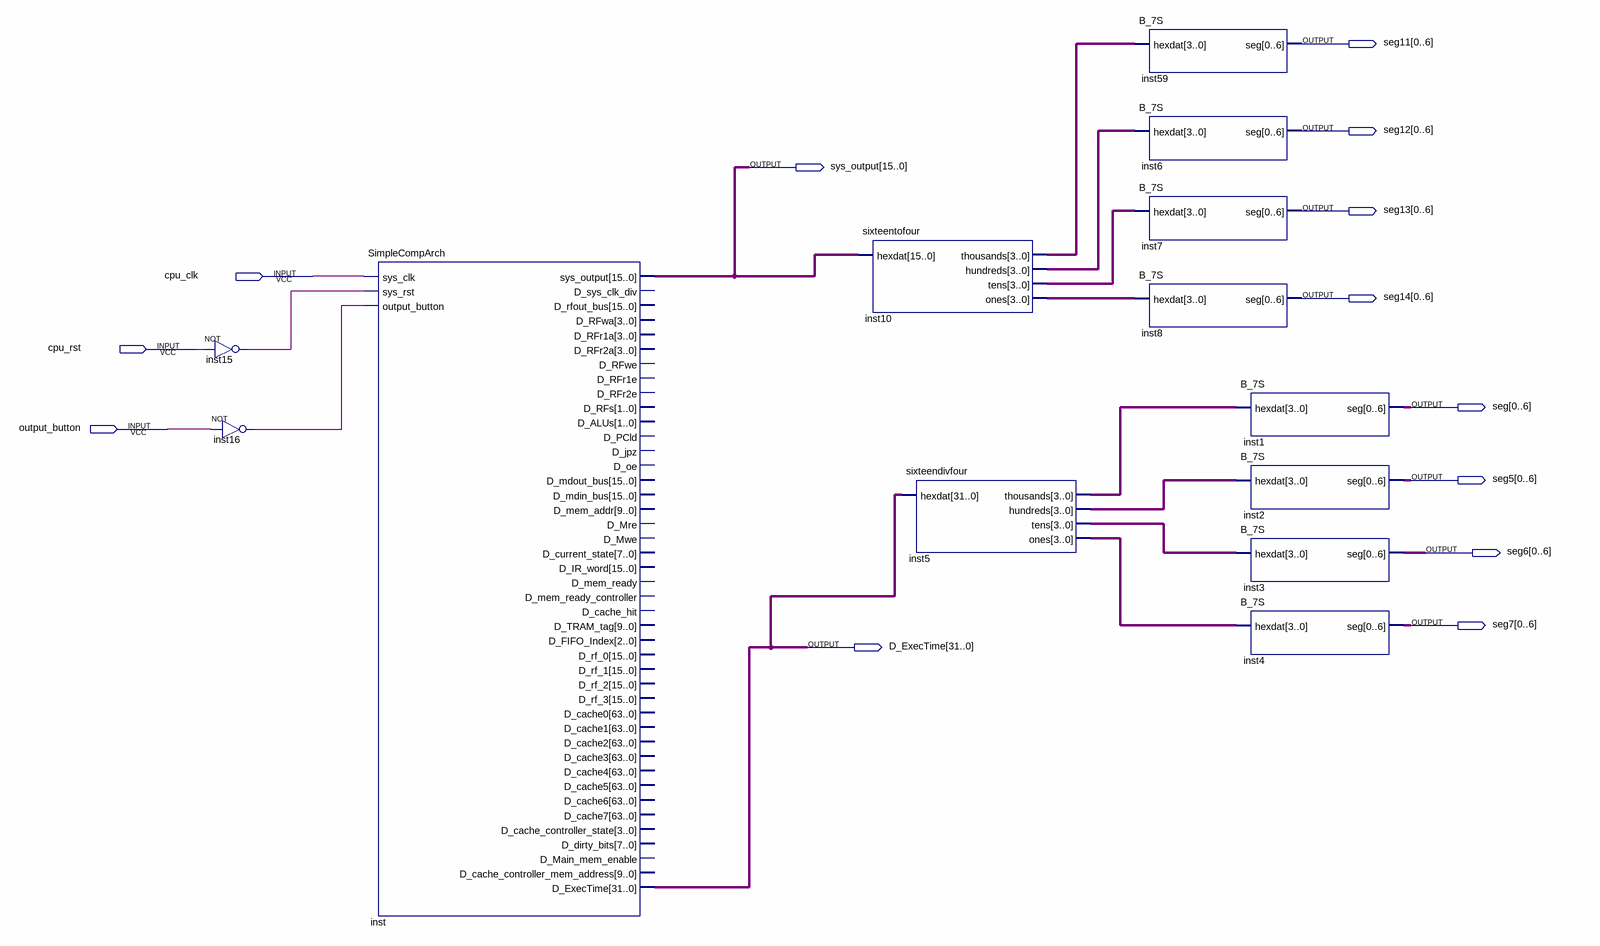
[diagram p0: schematic sheet]
// Quartus schematic SimpleCompArch_QII_14.bdf as structural Verilog: 13 symbols, 13 pins
module SimpleCompArch_QII_14 (
  input  cpu_clk,
  input  cpu_rst,
  input  output_button,
  output [0:6] seg11,
  output [0:6] seg12,
  output [15:0] sys_output,
  output [0:6] seg13,
  output [0:6] seg14,
  output [0:6] seg,
  output [0:6] seg5,
  output [0:6] seg6,
  output [0:6] seg7,
  output [31:0] D_ExecTime
);

  wire inst15_out, inst16_out;
  wire [3:0] inst5_hundreds, inst5_ones, inst5_tens, inst5_thousands, inst10_hundreds, inst10_ones,
       inst10_tens, inst10_thousands;

  not inst15 (inst15_out, cpu_rst);
  not inst16 (inst16_out, output_button);
  SimpleCompArch inst (
    .sys_clk(cpu_clk), .sys_rst(inst15_out), .output_button(inst16_out), .sys_output(sys_output),
    .D_ExecTime(D_ExecTime));  // open: D_sys_clk_div, D_rfout_bus, D_RFwa, D_RFr1a, D_RFr2a, D_RFwe, D_RFr1e, D_RFr2e, D_RFs, D_ALUs, D_PCld, D_jpz, D_oe, D_mdout_bus, D_mdin_bus, D_mem_addr, D_Mre, D_Mwe, D_current_state, D_IR_word, D_mem_ready, D_mem_ready_controller, D_cache_hit, D_TRAM_tag, D_FIFO_Index, D_rf_0, D_rf_1, D_rf_2, D_rf_3, D_cache0, D_cache1, D_cache2, D_cache3, D_cache4, D_cache5, D_cache6, D_cache7, D_cache_controller_state, D_dirty_bits, D_Main_mem_enable, D_cache_controller_mem_address
  sixteentofour inst10 (
    .hexdat(sys_output), .thousands(inst10_thousands), .hundreds(inst10_hundreds), .tens(inst10_tens),
    .ones(inst10_ones));
  sixteendivfour inst5 (
    .hexdat(D_ExecTime), .thousands(inst5_thousands), .hundreds(inst5_hundreds), .tens(inst5_tens),
    .ones(inst5_ones));
  B_7S inst59 (.hexdat(inst10_thousands), .seg(seg11));
  B_7S inst6 (.hexdat(inst10_hundreds), .seg(seg12));
  B_7S inst7 (.hexdat(inst10_tens), .seg(seg13));
  B_7S inst8 (.hexdat(inst10_ones), .seg(seg14));
  B_7S inst1 (.hexdat(inst5_thousands), .seg(seg));
  B_7S inst2 (.hexdat(inst5_hundreds), .seg(seg5));
  B_7S inst3 (.hexdat(inst5_tens), .seg(seg6));
  B_7S inst4 (.hexdat(inst5_ones), .seg(seg7));
endmodule
